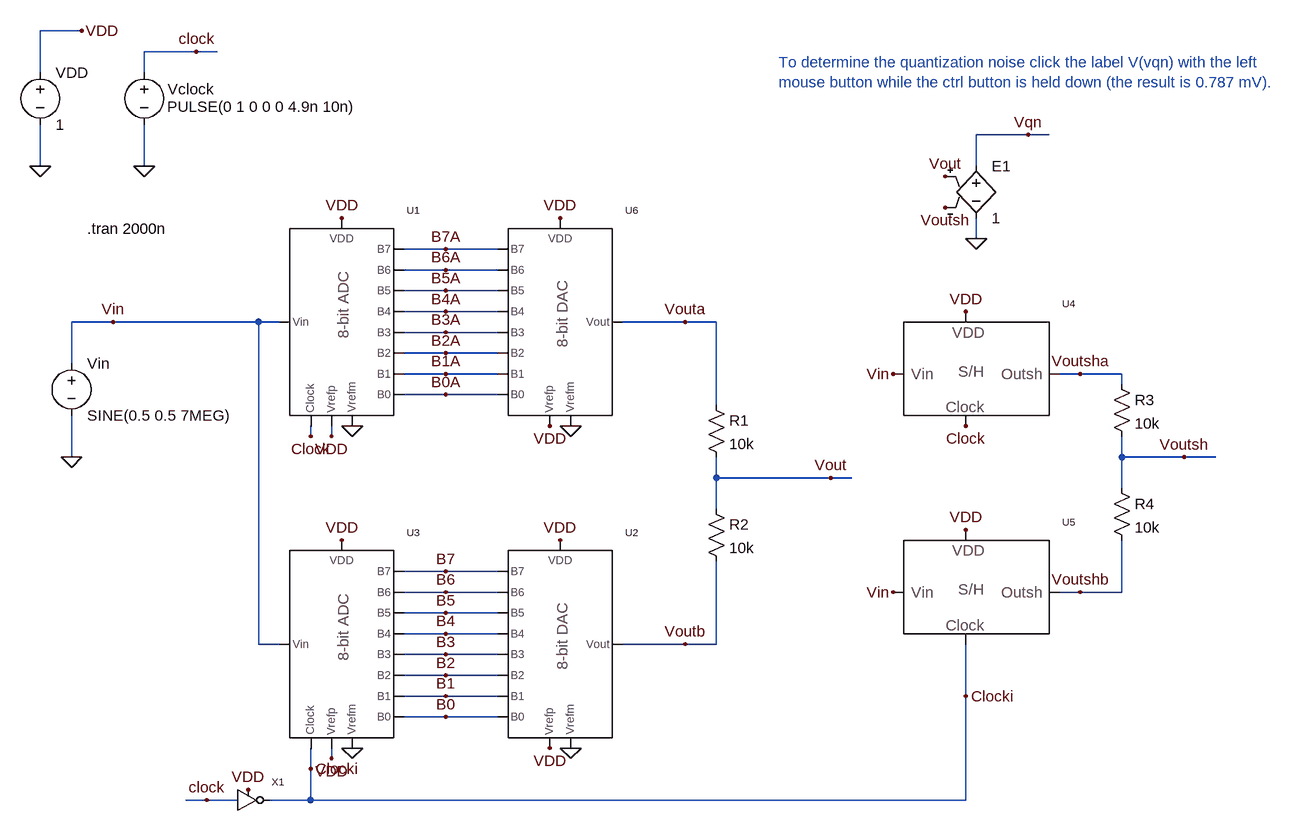
[diagram p0: schematic _Fig5_27_noise_MSD.asc]
_Fig5_27_noise_MSD.asc, the LTspice schematic file:
Version 4
SHEET 1 2740 1144
WIRE 464 -832 400 -832
WIRE 640 -800 560 -800
WIRE 672 -800 640 -800
WIRE 400 -768 400 -832
WIRE 560 -768 560 -800
WIRE 1920 -672 1840 -672
WIRE 1952 -672 1920 -672
WIRE 400 -624 400 -688
WIRE 560 -624 560 -688
WIRE 1840 -624 1840 -672
WIRE 1840 -512 1840 -544
WIRE 1024 -496 960 -496
WIRE 1104 -496 1024 -496
WIRE 1024 -464 960 -464
WIRE 1104 -464 1024 -464
WIRE 1024 -432 960 -432
WIRE 1104 -432 1024 -432
WIRE 1024 -400 960 -400
WIRE 1104 -400 1024 -400
WIRE 512 -384 448 -384
WIRE 736 -384 512 -384
WIRE 768 -384 736 -384
WIRE 1392 -384 1296 -384
WIRE 1440 -384 1392 -384
WIRE 1024 -368 960 -368
WIRE 1104 -368 1024 -368
WIRE 1024 -336 960 -336
WIRE 1104 -336 1024 -336
WIRE 448 -320 448 -384
WIRE 1024 -304 960 -304
WIRE 1104 -304 1024 -304
WIRE 2000 -304 1968 -304
WIRE 2064 -304 2000 -304
WIRE 2064 -288 2064 -304
WIRE 1024 -272 960 -272
WIRE 1104 -272 1024 -272
WIRE 1440 -256 1440 -384
WIRE 816 -208 816 -224
WIRE 848 -208 848 -224
WIRE 448 -176 448 -240
WIRE 2064 -176 2064 -208
WIRE 2160 -176 2064 -176
WIRE 2208 -176 2160 -176
WIRE 1440 -144 1440 -176
WIRE 1616 -144 1440 -144
WIRE 1648 -144 1616 -144
WIRE 2064 -128 2064 -176
WIRE 1440 -96 1440 -144
WIRE 1024 0 960 0
WIRE 1104 0 1024 0
WIRE 1024 32 960 32
WIRE 1104 32 1024 32
WIRE 2000 32 1968 32
WIRE 2064 32 2064 -48
WIRE 2064 32 2000 32
WIRE 1024 64 960 64
WIRE 1104 64 1024 64
WIRE 1024 96 960 96
WIRE 1104 96 1024 96
WIRE 736 112 736 -384
WIRE 768 112 736 112
WIRE 1392 112 1296 112
WIRE 1440 112 1440 -16
WIRE 1440 112 1392 112
WIRE 1024 128 960 128
WIRE 1104 128 1024 128
WIRE 1024 160 960 160
WIRE 1104 160 1024 160
WIRE 1024 192 960 192
WIRE 1104 192 1024 192
WIRE 1824 192 1824 112
WIRE 1024 224 960 224
WIRE 1104 224 1024 224
WIRE 848 288 848 272
WIRE 816 304 816 272
WIRE 656 352 624 352
WIRE 704 352 656 352
WIRE 816 352 816 304
WIRE 816 352 752 352
WIRE 1824 352 1824 192
WIRE 1824 352 816 352
FLAG 448 -176 0
FLAG 512 -384 Vin
FLAG 560 -624 0
FLAG 640 -800 clock
FLAG 400 -624 0
FLAG 464 -832 VDD
FLAG 1392 -384 Vouta
FLAG 1184 -224 VDD
FLAG 1216 -224 0
FLAG 1024 -496 B7A
FLAG 1024 -464 B6A
FLAG 1024 -432 B5A
FLAG 1024 -400 B4A
FLAG 1024 -368 B3A
FLAG 1024 -336 B2A
FLAG 1024 -304 B1A
FLAG 1024 -272 B0A
FLAG 1200 -544 VDD
FLAG 864 -544 VDD
FLAG 880 -224 0
FLAG 816 -208 Clock
FLAG 848 -208 VDD
FLAG 1392 112 Voutb
FLAG 1184 272 VDD
FLAG 1216 272 0
FLAG 1024 0 B7
FLAG 1024 32 B6
FLAG 1024 64 B5
FLAG 1024 96 B4
FLAG 1024 128 B3
FLAG 1024 160 B2
FLAG 1024 192 B1
FLAG 1024 224 B0
FLAG 1200 -48 VDD
FLAG 864 -48 VDD
FLAG 880 272 0
FLAG 816 304 Clocki
FLAG 848 288 VDD
FLAG 1616 -144 Vout
FLAG 1824 -400 VDD
FLAG 1712 -304 Vin
FLAG 1824 -224 Clock
FLAG 2000 -304 Voutsha
FLAG 1840 -512 0
FLAG 1792 -608 Vout
FLAG 1792 -560 Voutsh
FLAG 1920 -672 Vqn
FLAG 1824 -64 VDD
FLAG 1712 32 Vin
FLAG 1824 192 Clocki
FLAG 2000 32 Voutshb
FLAG 2160 -176 Voutsh
FLAG 656 352 clock
FLAG 720 336 VDD
SYMBOL voltage 448 -336 R0
WINDOW 123 0 0 Left 0
WINDOW 39 0 0 Left 0
SYMATTR InstName Vin
SYMATTR Value SINE(0.5 0.5 7MEG)
SYMBOL voltage 560 -784 R0
WINDOW 0 36 42 Left 0
WINDOW 3 35 69 Left 0
WINDOW 123 0 0 Left 0
WINDOW 39 0 0 Left 0
SYMATTR InstName Vclock
SYMATTR Value PULSE(0 1 0 0 0 4.9n 10n)
SYMBOL voltage 400 -784 R0
WINDOW 123 0 0 Left 0
WINDOW 39 0 0 Left 0
SYMATTR InstName VDD
SYMATTR Value 1
SYMBOL Ideal_8_bit_DAC 1120 -240 R0
SYMATTR InstName U6
SYMBOL Ideal_8_bit_ADC 784 -240 R0
SYMATTR InstName U1
SYMBOL Ideal_8_bit_DAC 1120 256 R0
SYMATTR InstName U2
SYMBOL Ideal_8_bit_ADC 784 256 R0
SYMATTR InstName U3
SYMBOL res 1424 -272 R0
SYMATTR InstName R1
SYMATTR Value 10k
SYMBOL res 1424 -112 R0
SYMATTR InstName R2
SYMATTR Value 10k
SYMBOL Sample_and_hold 1728 -240 R0
SYMATTR InstName U4
SYMBOL e 1840 -640 R0
SYMATTR InstName E1
SYMATTR Value 1
SYMBOL Sample_and_hold 1728 96 R0
SYMATTR InstName U5
SYMBOL res 2048 -304 R0
SYMATTR InstName R3
SYMATTR Value 10k
SYMBOL res 2048 -144 R0
SYMATTR InstName R4
SYMATTR Value 10k
SYMBOL inverter 704 352 R0
SYMATTR InstName X1
TEXT 472 -528 Left 0 !.tran 2000n
TEXT 1536 -784 Left 0 ;To determine the quantization noise click the label V(vqn) with the left\nmouse button while the ctrl button is held down (the result is 0.787 mV).

The netlist it stands for:
* _Fig5_27_noise_MSD.asc
Vin Vin 0 SINE(0.5 0.5 7MEG)
Vclock clock 0 PULSE(0 1 0 0 0 4.9n 10n)
VDD VDD 0 1
XU6 B7A B6A B5A B4A B3A B2A B1A B0A Vouta VDD 0 VDD Ideal_8_bit_DAC  ; pins B7 B6 B5 B4 B3 B2 B1 B0 Vout Vrefp Vrefm VDD
XU1 B7A B6A B5A B4A B3A B2A B1A B0A Vin VDD 0 clock VDD Ideal_8_bit_ADC  ; pins B7 B6 B5 B4 B3 B2 B1 B0 Vin Vrefp Vrefm Clock VDD
XU2 B7 B6 B5 B4 B3 B2 B1 B0 Voutb VDD 0 VDD Ideal_8_bit_DAC  ; pins B7 B6 B5 B4 B3 B2 B1 B0 Vout Vrefp Vrefm VDD
XU3 B7 B6 B5 B4 B3 B2 B1 B0 Vin VDD 0 Clocki VDD Ideal_8_bit_ADC  ; pins B7 B6 B5 B4 B3 B2 B1 B0 Vin Vrefp Vrefm Clock VDD
R1 Vouta Vout 10k
R2 Vout Voutb 10k
XU4 Vin Voutsha clock VDD Sample_and_hold  ; pins Vin Outsh Clock VDD
E1 Vqn 0 Vout Voutsh 1
XU5 Vin Voutshb Clocki VDD Sample_and_hold  ; pins Vin Outsh Clock VDD
R3 Voutsha Voutsh 10k
R4 Voutsh Voutshb 10k
XX1 clock Clocki VDD inverter  ; pins In Out VDD
.tran 2000n
* To determine the quantization noise click the label V(vqn) with the left
* mouse button while the ctrl button is held down (the result is 0.787 mV).
.backanno
.end